# Altium schematic sheet isolated-analog-interface-hw.SchDoc
size A1; SheetNumber: 4; SheetTotal: 10
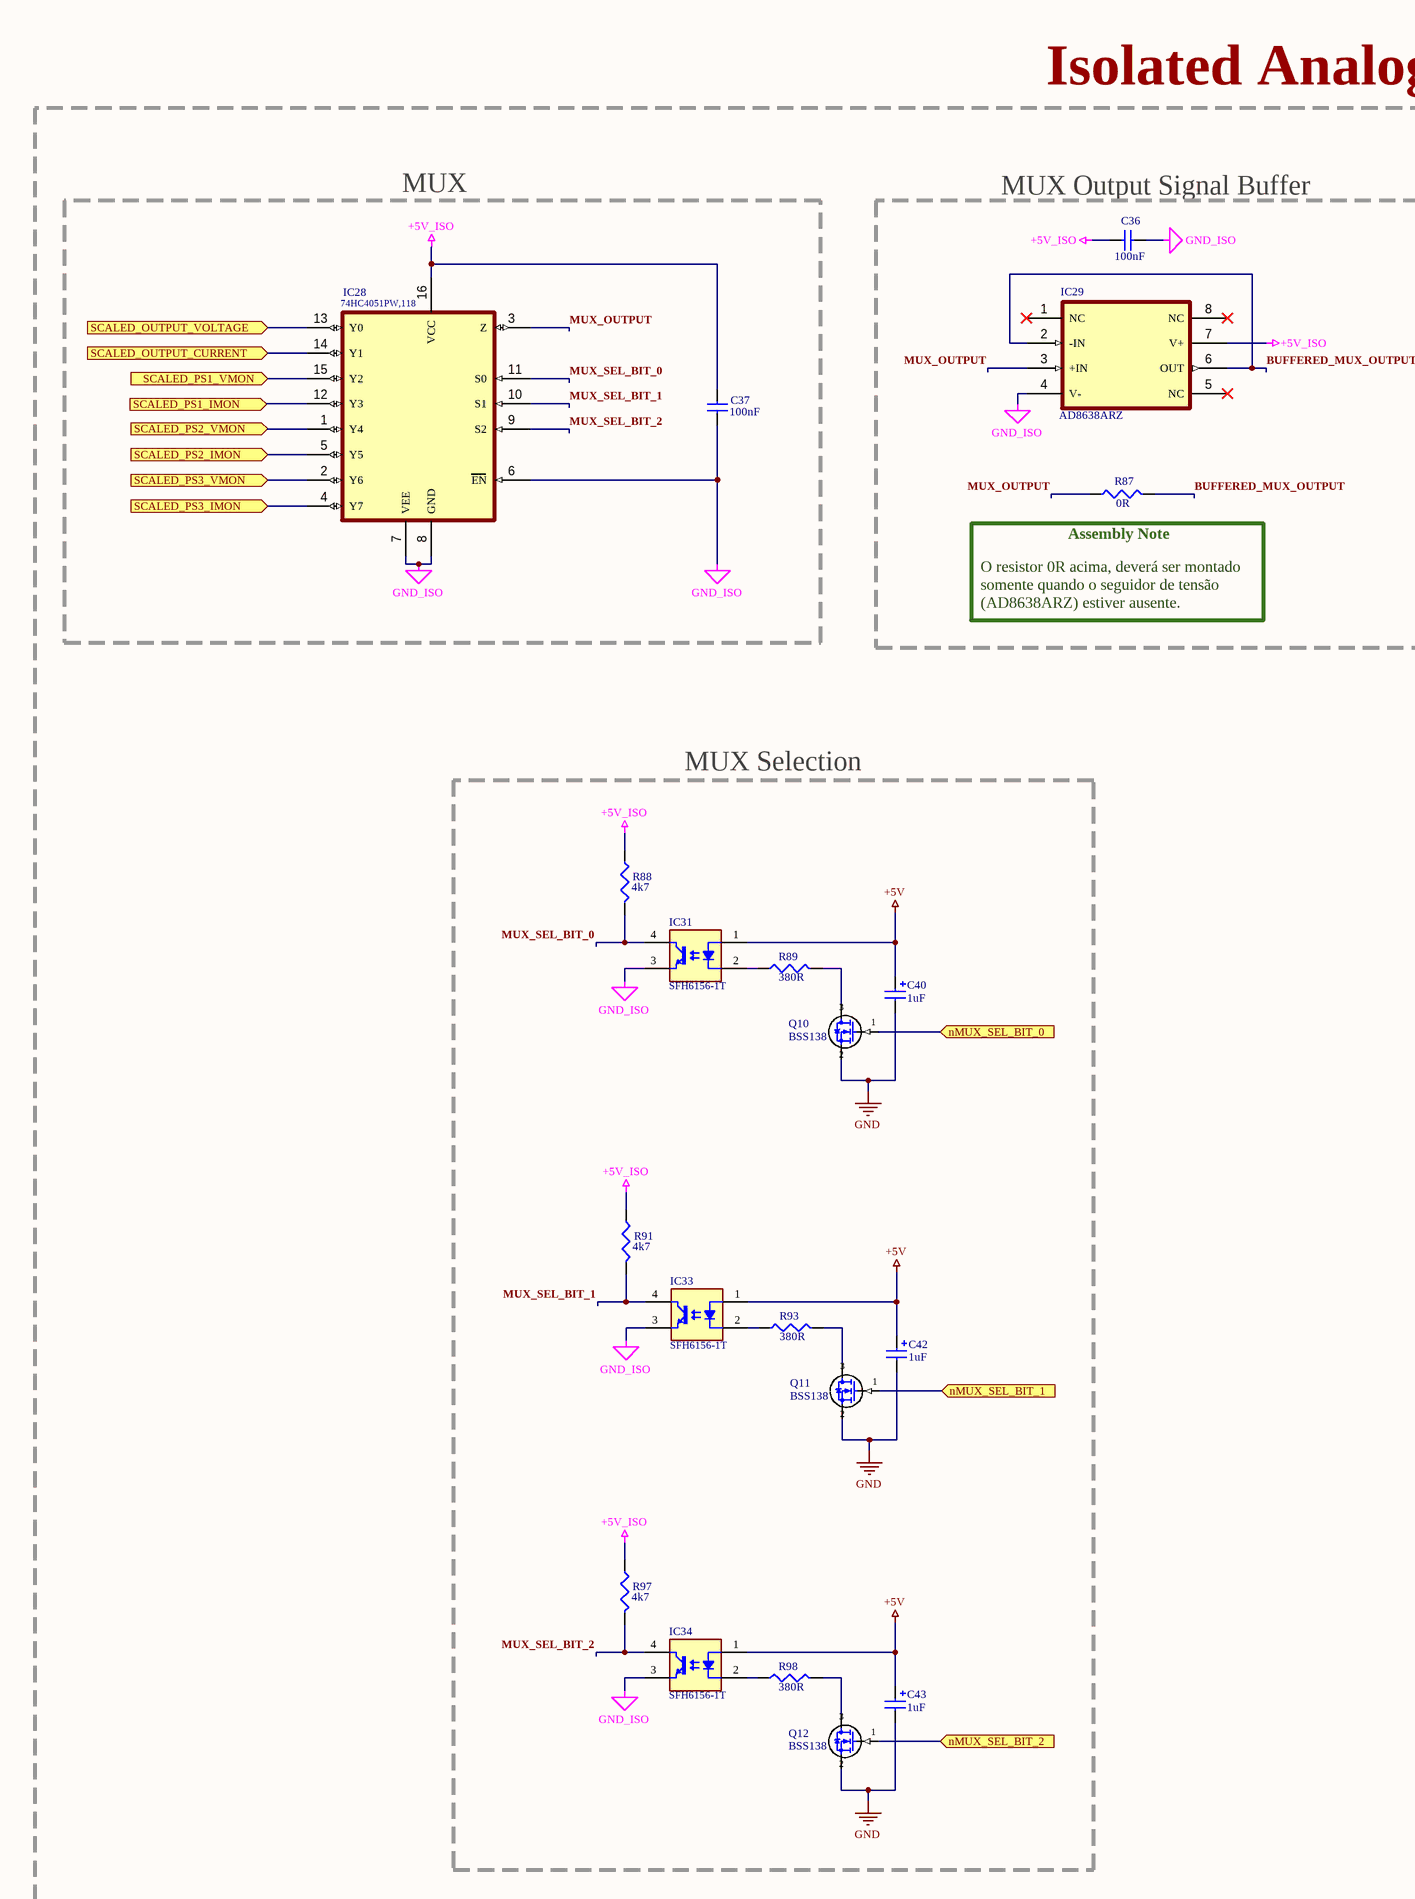
[diagram p0: isolated-analog-interface-hw.SchDoc, left]
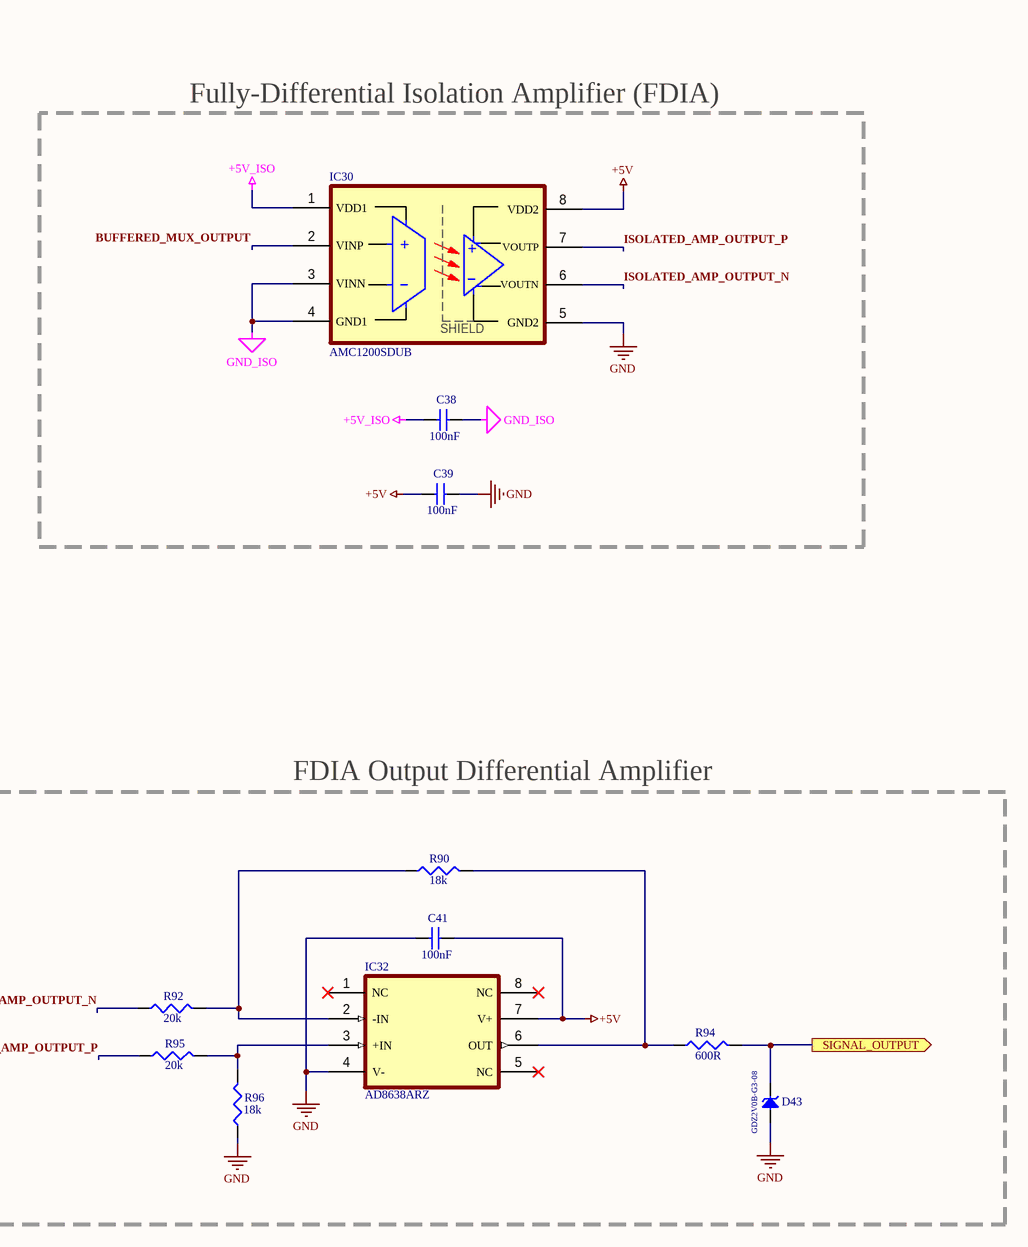
[diagram p1: isolated-analog-interface-hw.SchDoc, right]

## Parts
C36  100nF  [C0805]
C37  100nF  [C0805]
C38  100nF  [C0805]
C39  100nF  [C0805]
C40  1uF  [C1206]
C41  100nF  [C0805]
C42  1uF  [C1206]
C43  1uF  [C1206]
D43  GDZ2V0B-G3-08  [SOD-323]
IC28  74HC4051PW,118  [TSSOP-16]
IC29  AD8638ARZ  [SOIC-8]
IC30  AMC1200SDUB  [SOP-8]
IC31  SFH6156-1T  [SMD-4]
IC32  AD8638ARZ  [SOIC-8]
IC33  SFH6156-1T  [SMD-4]
IC34  SFH6156-1T  [SMD-4]
Q10  BSS138  [SOT_23_3]
Q11  BSS138  [SOT_23_3]
Q12  BSS138  [SOT_23_3]
R87  0R  [Resistor 0805]
R88  4k7  [Resistor 0805]
R89  380R  [Resistor 0805]
R90  18k  [Resistor 0805]
R91  4k7  [Resistor 0805]
R92  20k  [Resistor 0805]
R93  380R  [Resistor 0805]
R94  600R  [Resistor 0805]
R95  20k  [Resistor 0805]
R96  18k  [Resistor 0805]
R97  4k7  [Resistor 0805]
R98  380R  [Resistor 0805]

## Blocks framed on the sheet
MUX: C37 IC28
MUX Output Signal Buffer: C36 IC29 R87
Fully-Differential Isolation Amplifier (FDIA): C38 C39 IC30
MUX Selection: C40 C42 C43 IC31 IC33 IC34 Q10-Q12 R88 R89 R91 R93 R97 R98
FDIA Output Differential Amplifier: C41 D43 IC32 R90 R92 R94-R96

## Ports
nMUX_SEL_BIT_0 (in, see beaglebone-interface-hw[6A]), nMUX_SEL_BIT_1 (in, see beaglebone-interface-hw[6A]), nMUX_SEL_BIT_2 (in, see beaglebone-interface-hw[6B]), SCALED_OUTPUT_CURRENT (in, see measurement-output-hw[9D]), SCALED_OUTPUT_VOLTAGE (in, see measurement-output-hw[9B]), SCALED_PS1_IMON (in, see measurement-ps1-hw[6C]), SCALED_PS1_VMON (in, see measurement-ps1-hw[6B]), SCALED_PS2_IMON (in, see measurement-ps2-hw[6C]), SCALED_PS2_VMON (in, see measurement-ps2-hw[6B]), SCALED_PS3_IMON (in, see measurement-ps3-hw[6C]), SCALED_PS3_VMON (in, see measurement-ps3-hw[6B]), SIGNAL_OUTPUT (out, see beaglebone-interface-hw[6B])

## Nets
+5V: C39.1 C40.1 C41.2 C42.1 C43.1 IC30.8(VDD2) IC31.1(A) IC32.7(V+) IC33.1(A) IC34.1(A)
+5V_ISO: C36.1 C37.1 C38.1 IC28.16(VCC) IC29.7(V+) IC30.1(VDD1) R88.1 R91.1 R97.1
GND: C39.2 C40.2 C41.1 C42.2 C43.2 D43.1 IC30.5(GND2) IC32.4(V-) Q10.2(S) Q11.2(S) Q12.2(S) R96.1
GND_ISO: C36.2 C37.2 C38.2 IC28.6(EN) IC28.7(VEE) IC28.8(GND) IC29.4(V-) IC30.3(VINN) IC30.4(GND1) IC31.3(E) IC33.3(E) IC34.3(E)
BUFFERED_MUX_OUTPUT: IC29.2(-IN) IC29.6(OUT) IC30.2(VINP) R87.2
ISOLATED_AMP_OUTPUT_N: IC30.6(VOUTN) R92.1
ISOLATED_AMP_OUTPUT_P: IC30.7(VOUTP) R95.1
MUX_OUTPUT: IC28.3(Z) IC29.3(+IN) R87.1
MUX_SEL_BIT_0: IC28.11(S0) IC31.4(C) R88.2
MUX_SEL_BIT_1: IC28.10(S1) IC33.4(C) R91.2
MUX_SEL_BIT_2: IC28.9(S2) IC34.4(C) R97.2
nMUX_SEL_BIT_0: Q10.1(G) ; port nMUX_SEL_BIT_0
nMUX_SEL_BIT_1: Q11.1(G) ; port nMUX_SEL_BIT_1
nMUX_SEL_BIT_2: Q12.1(G) ; port nMUX_SEL_BIT_2
SCALED_OUTPUT_CURRENT: IC28.14(Y1) ; port SCALED_OUTPUT_CURRENT
SCALED_OUTPUT_VOLTAGE: IC28.13(Y0) ; port SCALED_OUTPUT_VOLTAGE
SCALED_PS1_IMON: IC28.12(Y3) ; port SCALED_PS1_IMON
SCALED_PS1_VMON: IC28.15(Y2) ; port SCALED_PS1_VMON
SCALED_PS2_IMON: IC28.5(Y5) ; port SCALED_PS2_IMON
SCALED_PS2_VMON: IC28.1(Y4) ; port SCALED_PS2_VMON
SCALED_PS3_IMON: IC28.4(Y7) ; port SCALED_PS3_IMON
SCALED_PS3_VMON: IC28.2(Y6) ; port SCALED_PS3_VMON
SIGNAL_OUTPUT: D43.2 R94.2 ; port SIGNAL_OUTPUT
NetIC31_2: IC31.2(C) R89.1
NetIC32_2: IC32.2(-IN) R90.1 R92.2
NetIC32_3: IC32.3(+IN) R95.2 R96.2
NetIC32_6: IC32.6(OUT) R90.2 R94.1
NetIC33_2: IC33.2(C) R93.1
NetIC34_2: IC34.2(C) R98.1
NetQ10_3: Q10.3(D) R89.2
NetQ11_3: Q11.3(D) R93.2
NetQ12_3: Q12.3(D) R98.2

Not connected (* = marked no-connect by the designer): IC29 1(NC)* 5(NC)* 8(NC)*; IC32 1(NC)* 5(NC)* 8(NC)*

## Notes on the sheet
- Isolated Analog Interface
- (near R87) Assembly Note
- O resistor 0R acima, deverá ser montado somente quando o seguidor de tensão (AD8638ARZ) estiver ausente.
- Title:
- Drawn by:
- Revision:
- Copyright CNPEM 2023.
  This documentation describes Open Hardware and is licensed under the CERN OHL S v2. You may redistribute and modify this documentation under the terms of the CERN OHL S v2. (https://www.ohwr.org/cernohl). This documentation is distributed WITHOUT ANY EXPRESS OR IMPLIED WARRANTY, INCLUDING OF MERCHANTABILITY, SATISFACTORY QUALITY AND FITNESS FOR A PARTICULAR PURPOSE. Please see the CERN OHL S v2 for applicable conditions.
- File:
- Date:
- Project:
- Time:
- Sheet
- of
- ENT - AIS - SEI
  Sistemas Eletrônicos e
  Instrumentação
- (in symbol AMC1200SDUB) +; SHIELD

## Library data of the parts
C36-C39 C41 = Capacitor 100nF
C40 C42 C43 = Capacitor 1uF
D43 = Zener GDZ2V0B-G3-08: Supplier 1: Arrow Electronics; Supplier Part Number 1: GDZ2V0B-G3-08
IC28 = 74HC4051PW,118: 8-channel analog multiplexer, TSSOP-16
IC29 IC32 = AD8638ARZ: 16V, Auto-Zero, Rail-to-Rail Output Operational Amplifiers
IC30 = AMC1200SDUB: Fully-Differential Isolation Amplifier
IC31 IC33 IC34 = SFH6156-1T: Optocoupler 1 Channel, Phototransistor Output, SMD-4
Q10-Q12 = BSS138: MOSFET N-Channel; Supplier 1: Digi-Key; Supplier Part Number 1: BSS138DKR-ND
R87 = Resistor 0R - 0805: Size 0805
R88 R91 R97 = Resistor 4k7: Size 0805
R89 R93 R98 = Resistor 380R: Size 0805
R90 R96 = Resistor 18k
R92 R95 = Resistor 20k
R94 = Resistor 600R